# Altium schematic sheet Sheet1.SchDoc: Detector CSN mod. 2
size A4; DrawnBy: RCP; Engineer: RCP; Organization: LIM-HGGM; Address1: RCP; DocumentNumber: 1; Revision: 1; SheetNumber: 1; SheetTotal: 2; PageSetup: Record=PageOptions|CenterHorizontal=True|CenterVertical=True|PrintScale=0.97|XCorrection=1.00|YCorrection=1.00|PrintKind=0|BorderSize=5000000|LeftOffset=0|BottomOffset=0|Orientation=2|PaperLength=1000|PaperWidth=1000|Scale=100|PaperSource=7|PrintQuality=-4|MediaType=1|DitherType=10|PaperKind=A4|PrintScaleMode=1
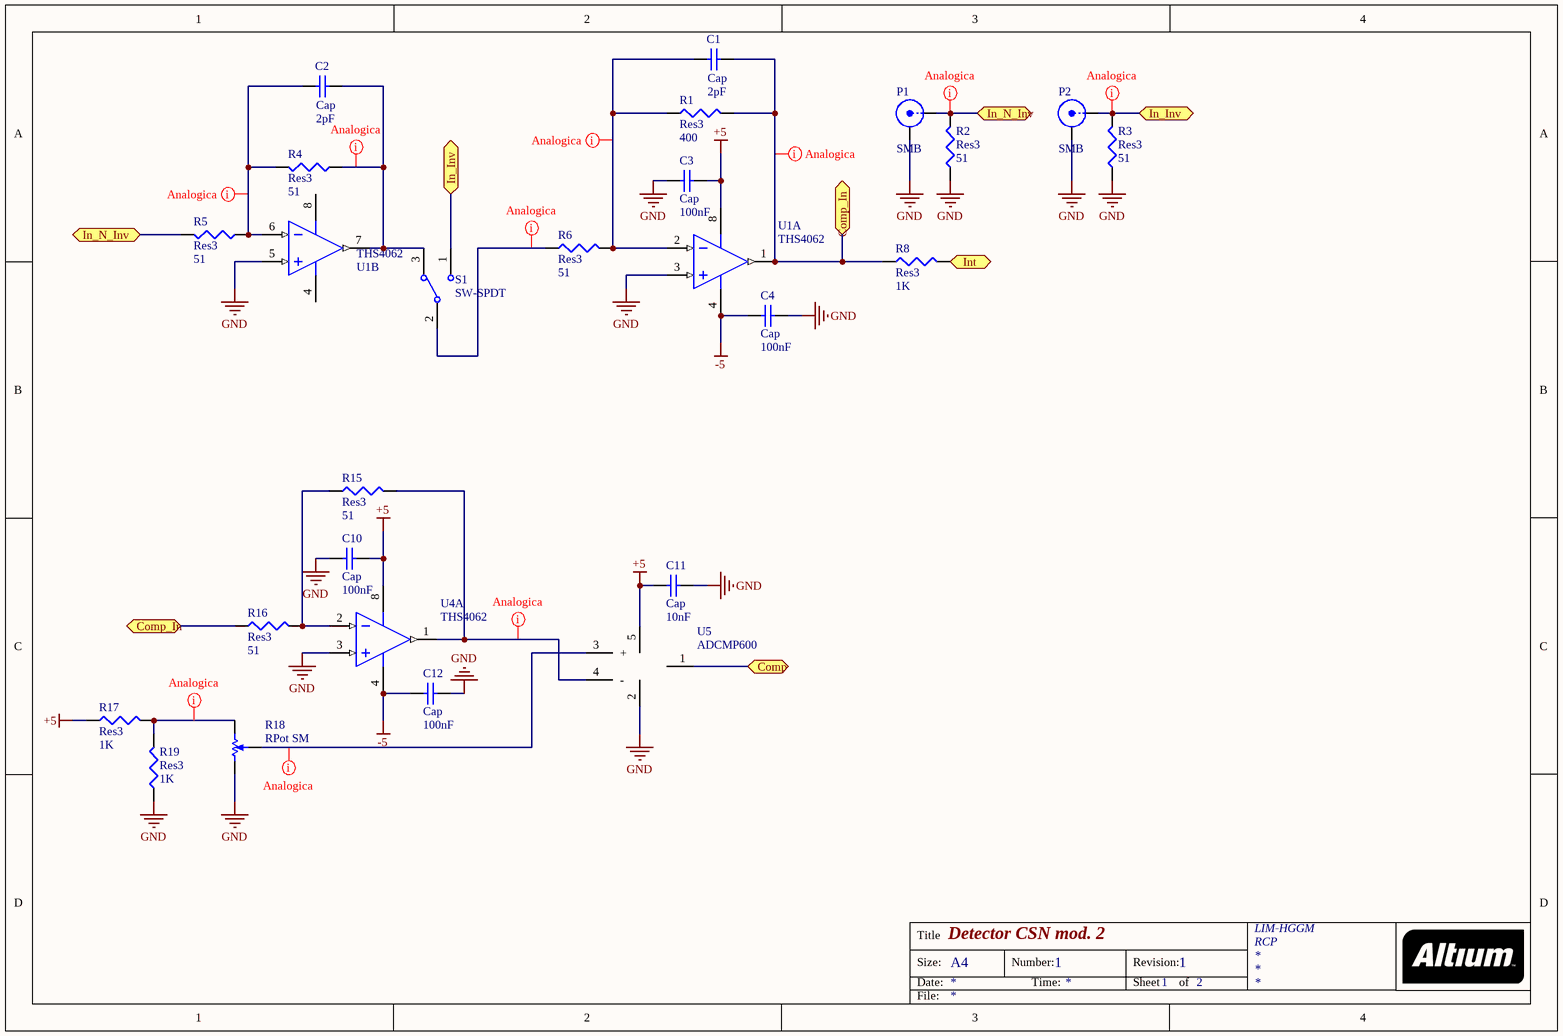
[diagram p0: Sheet1.SchDoc]

## Parts
C1  Cap  value 2pF  [6-0805_N]
C2  Cap  value 2pF  [6-0805_N]
C3  Cap  value 100nF  [6-0805_N]
C4  Cap  value 100nF  [6-0805_N]
C10  Cap  value 100nF  [6-0805_N]
C11  Cap  value 10nF  [6-0805_N]
C12  Cap  value 100nF  [6-0805_N]
P1  SMB  [SMB_V-RJ45]
P2  SMB  [SMB_V-RJ45]
R1  Res3  value 400  [6-0805_N]
R2  Res3  value 51  [6-0805_N]
R3  Res3  value 51  [6-0805_N]
R4  Res3  value 51  [6-0805_N]
R5  Res3  value 51  [6-0805_N]
R6  Res3  value 51  [6-0805_N]
R8  Res3  value 1K  [6-0805_N]
R15  Res3  value 51  [6-0805_N]
R16  Res3  value 51  [6-0805_N]
R17  Res3  value 1K  [6-0805_N]
R18  RPot SM  [POT4MM-2]
R19  Res3  value 1K  [6-0805_N]
S1  SW-SPDT  [HDR1X3]
U1  THS4062  [S8_N]  (parts A,B of 2)
U4  THS4062  [S8_N]  (part A of 2)
U5  ADCMP600  [SOT23-5_N]

## Ports
Comp, Comp_In, In_Inv, In_N_Inv, Int (out)

## Nets
+5: C3.2 C10.2 C11.1 R17.1 U1.8(V+) U4.8(V+) U5.5
-5: C4.1 C12.1 U1.4(V-) U4.4(V-)
GND: C3.1 C4.2 C10.1 C11.2 C12.2 P1.2(Y) P2.2(Y) R2.1 R3.1 R18.CCW(-) R19.1 U1.3(IN+) U1.5(IN+) U4.3(IN+) U5.2
Comp: U5.1 ; port Comp
Comp_In: C1.2 R1.2 R8.1 R16.1 U1.1(OUT) ; port Comp_In
In_Inv: P2.1(X) R3.2 S1.1 ; port In_Inv
In_N_Inv: P1.1(X) R2.2 R5.2 ; port In_N_Inv
Int: R8.2 ; port Int
NetC1_1: C1.1 R1.1 R6.2 U1.2(IN-)
NetC2_1: C2.1 R4.2 R5.1 U1.6(IN-)
NetC2_2: C2.2 R4.1 S1.3 U1.7(OUT)
NetR6_1: R6.1 S1.2
NetR15_1: R15.1 R16.2 U4.2(IN-)
NetR15_2: R15.2 U4.1(OUT) U5.4(-)
NetR17_2: R17.2 R18.CW(+) R19.2
NetR18_W: R18.W U5.3(+)

## Layout directives
net class analog: Comp_In, In_Inv, In_N_Inv, NetC1_1, NetC2_1, NetC2_2, NetR6_1, NetR15_2, NetR17_2, NetR18_W

## Notes on the sheet
- Title
- Size:
- Date:
- A4
- Number:
- Time:
- Revision:
- Sheet
- of
- File:

## Library data of the parts
C1-C4 C10-C12 = Cap: Capacitor; Published: 8-Jun-2000; LatestRevisionDate: 17-Jul-2002; LatestRevisionNote: Re-released for DXP Platform.; PackageReference: RAD-0.3; Publisher: Altium Limited; PackageDescription: Radial Cap, Thru-Hole; 2 Leads; 0.3 in Pin Spacing
P1 P2 = SMB: SMB Straight Connector; LatestRevisionDate: 17-Jul-2002; LatestRevisionNote: Re-released for DXP Platform.; Publisher: Altium Limited
R1-R6 R8 R15-R17 R19 = Res3: Resistor; Published: 8-Jun-2000; LatestRevisionDate: 29-May-2009; LatestRevisionNote: IPC-7351 Footprint Added.; PackageReference: J1-0603; Publisher: Altium Limited; PackageDescription: Chip Resistor
R18 = RPot SM: Square Trimming Potentiometer; Published: 17-Dec-2003; DatasheetVersion: Oct-2003; PackageReference: POT4MM-2; Publisher: Altium Limited; PackageDescription: Square Trimming Potentiometer; ComponentLink1Description: Manufacturer Link; ComponentLink1URL: http://bourns.com/2/search.html
S1 = SW-SPDT: SPDT Subminiature Toggle Switch, Right Angle Mounting, Vertical Actuation; Published: 24-Mar-1999; LatestRevisionDate: 17-Dec-2003; LatestRevisionNote: Schematic revised, PCB Footprint replaced.; DatasheetVersion: 05-Dec-2000; PackageReference: TL36WW15050; Publisher: Altium Limited; PackageDescription: Switch; 4 Leads; ComponentLink1Description: Manufacturer Link; ComponentLink1URL: http://www.apem.com
U1 U4 = LT1253CS8: Low Cost Dual Video Amplifier; Note: 1003; Published: 8-Jun-2000; LatestRevisionDate: 13-Apr-2006; LatestRevisionNote: IPC-7351 Footprint Added.; DatasheetVersion: 1996; PackageReference: S8; Publisher: Altium Limited; PackageDescription: 8-Pin Small Outline Integrated Circuit 1.27 mm Pitch; Code_JEDEC: MS-012-AA; Code_IPC: SOIC127P600-8; ComponentLink1Description: Manufacturer Link; ComponentLink1URL: http://www.linear.com/; ComponentLink2Description: Datasheet; ComponentLink2URL: http://www.linear.com/pc/downloadDocument.do?navId=H0,C1,C1154,C1009,C1022,P1423,D1129